# EAGLE design Smarty-BOTTOM (EAGLE 9.5.1)
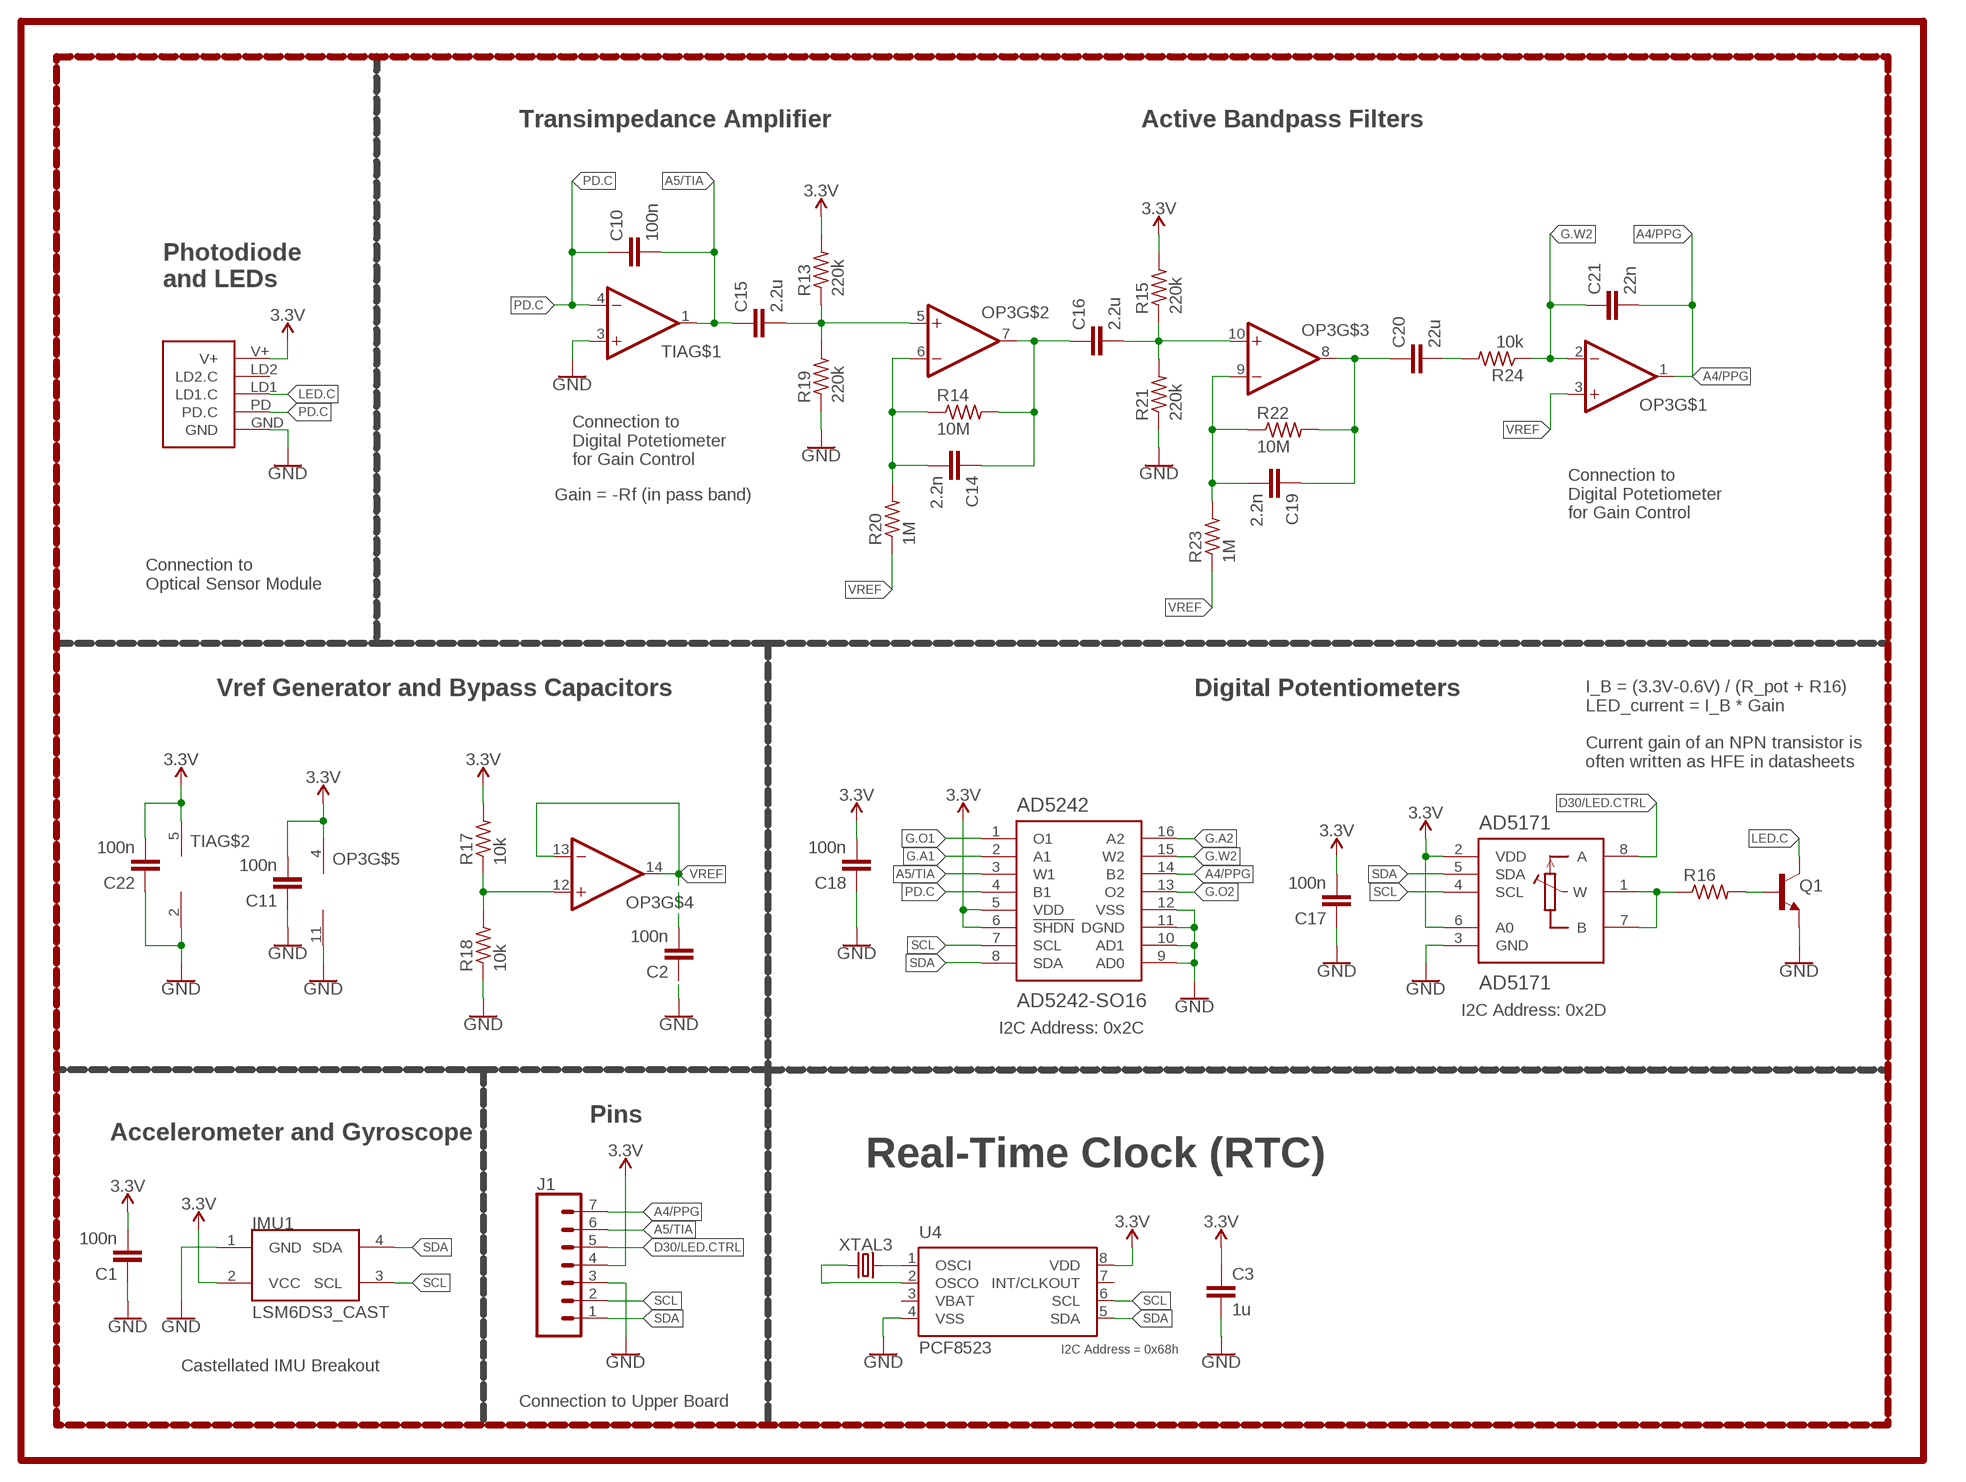
[diagram p0: schematic, sheet 1]

## Parts
AD5171  AD5171  [SOT-23-8]
AD5242  AD5242-SO16  [SO16]
C1  100n  CAPACITOR0603  [C0603]
C2  100n  CAPACITOR0603  [C0603]
C3  1u  CAPACITOR0603  [C0603]
C10  100n  CAPACITOR0603  [C0603]
C11  100n  CAPACITOR0603  [C0603]
C14  2.2n  CAPACITOR0603  [C0603]
C15  2.2u  CAPACITOR0603  [C0603]
C16  2.2u  CAPACITOR0603  [C0603]
C17  100n  CAPACITOR0603  [C0603]
C18  100n  CAPACITOR0603  [C0603]
C19  2.2n  CAPACITOR0603  [C0603]
C20  22u  CAPACITOR0603  [C0603]
C21  22n  CAPACITOR0603  [C0603]
C22  100n  CAPACITOR0603  [C0603]
IMU1  LSM6DS3_CAST  [LSM6DS3_CAST]
J1  CONN_07-1.27MM  [1X07_1.27MM]
OP3  OP-QUAD-SO14  [SO14]
Q1  NPN-GENERIC  [SOT23-3]
R13  220k  RESISTOR0603  [R0603]
R14  10M  RESISTOR0603  [R0603]
R15  220k  RESISTOR0603  [R0603]
R16  RESISTOR0603  [R0603]
R17  10k  RESISTOR0402  [R0402]
R18  10k  RESISTOR0402  [R0402]
R19  220k  RESISTOR0603  [R0603]
R20  1M  RESISTOR0603  [R0603]
R21  220k  RESISTOR0603  [R0603]
R22  10M  RESISTOR0603  [R0603]
R23  1M  RESISTOR0603  [R0603]
R24  10k  RESISTOR0603  [R0603]
TIA  OP-SINGLEOT  [SOT23-5]
U4  PCF8523  [SO8]
U$3  PPG.MODULE.2  [PPG.MODULE.2]
XTAL3  32.7680kHz  CRYSTALECS-.327-12.5-12-C-TR  [2-SMD.NOLEAD.2.0MMTO1.2MM]

## Nets
3.3V: AD5171.2(VDD) AD5171.6(A0) AD5242.5(VDD) AD5242.6(!SHDN) C1.2 C3.1 C11.2 C17.2 C18.2 C22.2 IMU1.2(VCC) J1.4 OP3.4(V+) R13.2 R15.2 R17.2 TIA.5(V+) U4.8(VDD) U$3.V+
A4/PPG: AD5242.14(B2) C21.2 J1.7 OP3.1(OUT)
A5/TIA: AD5242.3(W1) C10.2 C15.1 J1.6 TIA.1(OUT)
D30/LED.CTRL: AD5171.8(A) J1.5
G.A1: AD5242.2(A1)
G.A2: AD5242.16(A2)
G.O1: AD5242.1(O1)
G.O2: AD5242.13(O2)
G.W2: AD5242.15(W2) C21.1 OP3.2(-IN) R24.1
GND: AD5171.3(GND) AD5242.9(AD0) AD5242.10(AD1) AD5242.11(DGND) AD5242.12(VSS) C1.1 C2.1 C3.2 C11.1 C17.1 C18.1 C22.1 IMU1.1(GND) J1.3 OP3.11(V-) Q1.2(E) R18.1 R19.1 R21.1 TIA.2(V-) TIA.3(+IN) U4.4(VSS) U$3.GND
LED.C: Q1.3(C) U$3.LD1(LD1.C)
N$1: U4.2(OSCO) XTAL3.P$1
N$2: U4.1(OSCI) XTAL3.P$2
N$8: Q1.1(B) R16.2
N$9: AD5171.1(W) AD5171.7(B) R16.1
N$10: OP3.12(+IN) R17.1 R18.2
N$13: C15.2 OP3.5(+IN) R13.1 R19.2
N$15: C14.2 OP3.6(-IN) R14.1 R20.2
N$16: C14.1 C16.1 OP3.7(OUT) R14.2
N$17: C16.2 OP3.10(+IN) R15.1 R21.2
N$18: C19.2 OP3.9(-IN) R22.1 R23.2
N$19: C19.1 C20.1 OP3.8(OUT) R22.2
N$20: C20.2 R24.2
PD.C: AD5242.4(B1) C10.1 TIA.4(-IN) U$3.PD(PD.C)
SCL: AD5171.4(SCL) AD5242.7(SCL) IMU1.3(SCL) J1.2 U4.6(SCL)
SDA: AD5171.5(SDA) AD5242.8(SDA) IMU1.4(SDA) J1.1 U4.5(SDA)
VREF: C2.2 OP3.3(+IN) OP3.13(-IN) OP3.14(OUT) R20.1 R23.1
Unconnected: U4.7(INT/CLKOUT) U$3.LD2(LD2.C)

## Notes on the sheet
- Transimpedance Amplifier | Active Bandpass Filters
- Photodiode
  and LEDs
- Connection to 
  Digital Potetiometer
  for Gain Control
- Gain = -Rf (in pass band)
- Connection to 
  Digital Potetiometer
  for Gain Control
- Connection to 
  Optical Sensor Module
- Vref Generator and Bypass Capacitors | Digital Potentiometers
- I_B = (3.3V-0.6V) / (R_pot + R16)
  LED_current = I_B * Gain
  
  Current gain of an NPN transistor is 
  often written as HFE in datasheets
- I2C Address: 0x2D
- I2C Address: 0x2C
- Pins
- Accelerometer and Gyroscope
- Real-Time Clock (RTC)
- I2C Address = 0x68h
- Castellated IMU Breakout
- Connection to Upper Board

## Power pins joined to a net without a drawn wire
VBAT: U4.3(VBAT)

## Library data of the parts
AD5171 = LinnesLab-DigitalIC:AD5171
AD5242 = LinnesLab-DigitalIC:AD5242
C1-C3 C10 C11 C14-C22 = LinnesLab-Passives:CAPACITOR
IMU1 = LinnesLab-Sensors:LSM6DS3_CAST
J1 = LinnesLab-Connectors:CONN_07: Multi connection point. Often used as Generic Header-pin footprint for 0.1 inch spaced/style header connections On any of the 0.1 inch spaced packages, you can populate with these: Break Away Headers - Straight <https://www.sparkfun.com/products/116> (PRT-00116) Break Away Male Headers - Right Angle <https://www.sparkfun.com/products/553> (PRT-00553) Female Headers <https://www.sparkfun.com/products/115> (PRT-00115) Break Away Headers - Machine Pin <https://www.sparkfun.com/products/117> (PRT-00117) Break Away Female Headers - Swiss Machine Pin <https://www.sparkfun.com/products/743> (PRT-00743) For SCREWTERMINALS and SPRING TERMINALS visit here: Screw Terimnals on SparkFun.com <https://www.sparkfun.com/search/results?term=Screw+Terminals> (5mm/3.5mm/2.54mm spacing) This device is also useful as a general connection point to wire up your design to another part of your project. Our various solder wires solder well into these plated through hole pads. Hook-Up Wire - Assortment (Stranded, 22 AWG) <https://www.sparkfun.com/products/11375> (PRT-11375) Hook-Up Wire - Assortment (Solid Core, 22 AWG) <https://www.sparkfun.com/products/11367> (PRT-11367) View the entire wire category on our website here <https://www.sparkfun.com/categories/141> Special notes: Molex polarized connector foot print use with SKU : PRT-08231 with associated crimp pins and housings. 1MM SMD Version SKU: PRT-10208 NOTES ON THE VARIANTS LOCK and LOCK_LONGPADS... This footprint was designed to help hold the alignment of a through-hole component (i.e. 6-pin header) while soldering it into place. You may notice that each hole has been shifted either up or down by 0.005 of an inch from it's more standard position (which is a perfectly straight line). This slight alteration caused the pins (the squares in the middle) to touch the edges of the holes. Because they are alternating, it causes a "brace" to hold the component in place. 0.005 has proven to be the perfect amount of "off-center" position when using our standard breakaway headers. Although looks a little odd when you look at the bare footprint, once you have a header in there, the alteration is very hard to notice. Also,if you push a header all the way into place, it is covered up entirely on the bottom side.
OP3 = LinnesLab-AnalogIC:OP-QUAD: General symbol and footprints for Quad Op Amps. Use with any standard general purpose op amp.
Q1 = LinnesLab-DiscreteSemi:NPN
R13-R24 = LinnesLab-Passives:RESISTOR
TIA = LinnesLab-AnalogIC:OP-SINGLE: Single Op Amp 2.7V to 6.0V Single Supply CMOS Source: http://ww1.microchip.com/downloads/en/DeviceDoc/21314g.pdf
U4 = LinnesLab-Clocks:PCF8523; DIGIKEY: 568-5306-1-ND; I2C_ADDRESS: 0x68h; MFN: PCF8523T/1,118; MFN_MANUFACTURER: NXP USA Inc.
U$3 = LinnesLab-Connectors:PPG.MODULE.2: Digi-Key Part Number: S9014E-50-ND Manufacturer Part Number: GRPB501VWVN-RC Description: 1mm insulation height 0.05in pitch 50 positions
XTAL3 = LinnesLab-Clocks:CRYSTAL

## Board
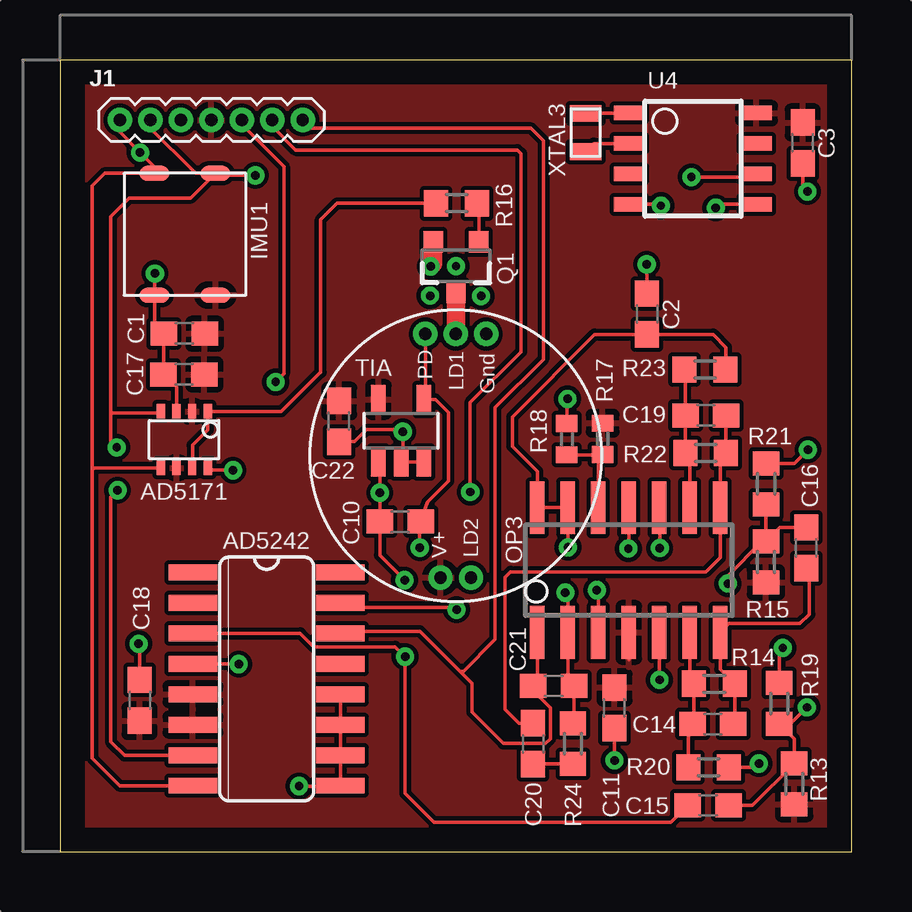
[diagram p1: board, top side]
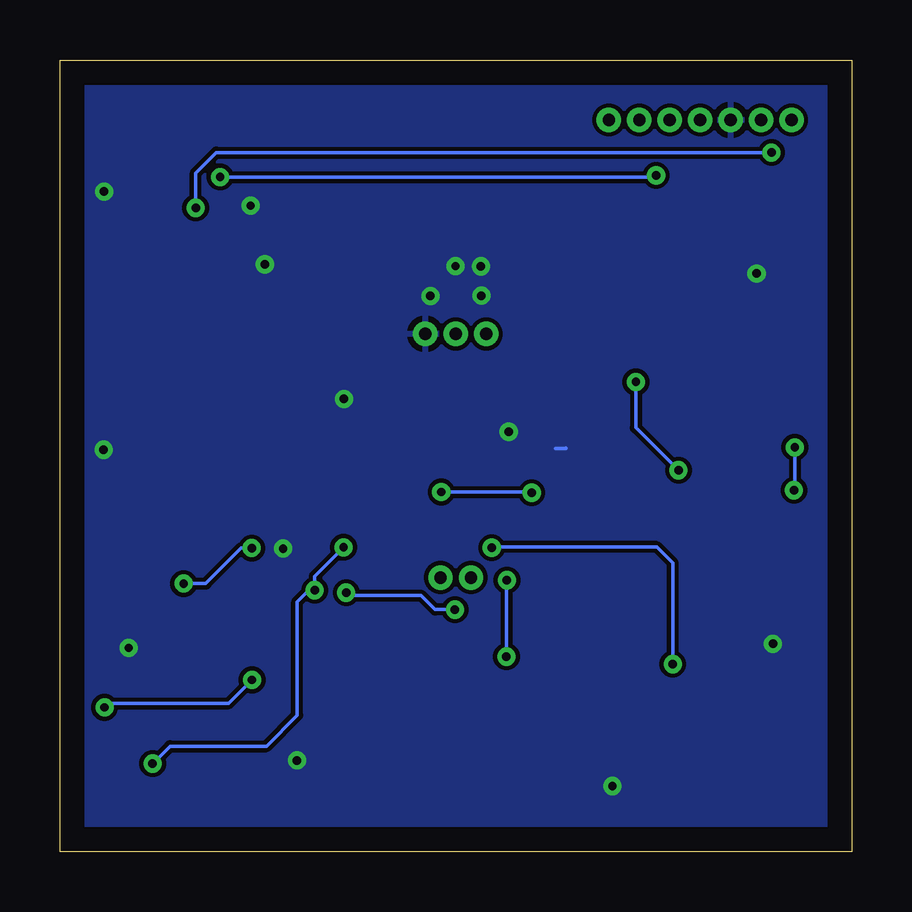
[diagram p2: board, bottom side, seen from below]

Size 33 x 33 mm. Coordinates in mm from the lower left corner, seen from the top.
Outline: 0,0 33,0 33,33 0,33 0,0
Copper layers (1*16): Top 0.035mm / dielectric 1.5mm / Bottom 0.035mm
Design rules "default": minimum track width 6mil, minimum drill 0.35mm, track to track 6mil, track to pad 6mil, pad to pad 6mil, via to via 6mil, smd to smd 6mil, copper to edge 40mil, drill to drill 6mil, minimum pad ring 10mil, minimum via ring 8mil, stop-mask expansion 4mil, vias tented up to drill 0mil, thermal gap 10mil

### Footprints (pad centres in the part's own frame; a part is rotated, then mirrored left to right if it is on the bottom)
SOT-23-8 = smd 0.35 x 0.6: 1 -0.991,-1.176; 2 -0.341,-1.176; 3 0.309,-1.176; 4 0.959,-1.176; 5 0.959,1.176; 6 0.309,1.176; 7 -0.341,1.176; 8 -0.991,1.176
SO16 = smd 0.66 x 2.032: 1 -4.445,-3.073; 2 -3.175,-3.073; 3 -1.905,-3.073; 4 -0.635,-3.073; 5 0.635,-3.073; 6 1.905,-3.073; 7 3.175,-3.073; 8 4.445,-3.073; 9 4.445,3.073; 10 3.175,3.073; 11 1.905,3.073; 12 0.635,3.073; 13 -0.635,3.073; 14 -1.905,3.073; 15 -3.175,3.073; 16 -4.445,3.073
C0603 = smd 1.1 x 1: 1 -0.85,0; 2 0.85,0
LSM6DS3_CAST = smd 0.635 x 1.27: 1 -2.54,1.27; 2 -2.54,-1.27; 3 2.54,-1.27; 4 2.54,1.27
1X07_1.27MM = drill 0.508 pad 1: 1 0,0; 2 1.27,0; 3 2.54,0; 4 3.81,0; 5 5.08,0; 6 6.35,0; 7 7.62,0
SO14 = smd 0.6 x 2.2: 1 -3.81,-2.6; 2 -2.54,-2.6; 3 -1.27,-2.6; 4 0,-2.6; 5 1.27,-2.6; 6 2.54,-2.6; 7 3.81,-2.6; 8 3.81,2.6; 9 2.54,2.6; 10 1.27,2.6; 11 0,2.6; 12 -1.27,2.6; 13 -2.54,2.6; 14 -3.81,2.6
SOT23-3 = smd 0.8 x 0.9: 1 -0.95,-1; 2 0.95,-1; 3 0,1.1
R0603 = smd 1 x 1.1: 1 -0.85,0; 2 0.85,0
R0402 = smd 0.7 x 0.9: 1 -0.65,0; 2 0.65,0
SOT23-5 = smd 0.6 x 1.2: 1 -0.95,-1.306; 2 0,-1.306; 3 0.95,-1.306; 4 0.95,1.306; 5 -0.95,1.306
SO8 = smd 1.3 x 0.6: 1 -2.65,1.905; 2 -2.65,0.635; 3 -2.65,-0.635; 4 -2.65,-1.905; 5 2.65,-1.905; 6 2.65,-0.635; 7 2.65,0.635; 8 2.65,1.905
PPG.MODULE.2 = drill 0.508 pad 0.94: GND 1.27,5.08; LD1 0,5.08; LD2 0.635,-5.08; PD -1.27,5.08; V+ -0.635,-5.08
2-SMD.NOLEAD.2.0MMTO1.2MM = smd 0.7 x 1.3: P$1 -0.8,0; P$2 0.8,0

### Placement (x,y rotation side)
AD5171  5.17,17.17 180 top
AD5242  8.62,7.19 270 top
C1  5.19,21.59 0 top
C2  24.47,22.41 270 top
C3  30.96,29.54 270 top
C10  14.19,13.76 180 top
C11  23.12,5.99 90 top
C14  27.22,5.31 180 top
C15  27.02,1.92 0 top
C16  31.1,12.66 90 top
C17  5.17,19.9 0 top
C18  3.32,6.31 270 top
C19  26.93,18.19 180 top
C20  19.71,4.5 270 top
C21  20.58,6.91 180 top
C22  11.64,17.94 90 top
IMU1  5.21,25.73 90 top
J1  2.5,30.5 0 top
OP3  23.71,11.73 0 top
Q1  16.51,24.42 180 top
R13  30.61,2.82 270 top
R14  27.28,6.99 0 top
R15  29.43,12.07 270 top
R16  16.54,27.03 0 top
R17  22.62,17.21 90 top
R18  21.13,17.19 270 top
R19  29.98,6.17 270 top
R20  27.04,3.51 180 top
R21  29.44,15.33 270 top
R22  26.92,16.62 0 top
R23  26.89,20.09 180 top
R24  21.38,4.5 270 top
TIA  14.22,17.54 0 top
U4  26.39,28.88 0 top
U$3  16.5,16.5 0 top
XTAL3  21.91,29.97 90 top

### Tracks (layer width: path | path; a pad name or v marks a point on that pad's centre or on a via)
3.3V
  Top 0.152: 23.71,8 OP3.4
  pour Top (isolate 0.178): 1.01,32.07 32.02,32.07 32.02,0.93 0.93,0.93 0.93,1.01 0.98,1.01 0.98,32.07 0.98,32.09
A4/PPG
  Top 0.152: OP3.1 19.9,7.08 C21.2 19.73,6.7 20.44,5.99 20.44,4.7 20.25,4.51 18.49,4.51 17.18,5.82 17.18,7.01 16.67,7.52 | AD5242.14 11.77,9.18 15.01,9.18 16.67,7.52 | 16.67,7.52 16.82,7.52 18.14,8.84 18.14,18.52 20.15,20.52 20.15,29.64 19.64,30.15 10.47,30.15 J1.7
A5/TIA  (via drill 0.35)
  Top 0.152: TIA.1 13.34,16.17 v13.34,14.96 C10.2 13.34,12.35 v14.37,11.31 | C15.1 25.47,1.22 15.59,1.22 14.39,2.42 v14.39,8.13 13.98,8.54 10.58,8.54 10.02,9.1 AD5242.3 | v17.1,14.99 17.1,18.72 19.22,20.83 19.22,29.1 19.07,29.25 9.83,29.25 8.85,30.23 J1.6
  Bottom 0.152: v14.37,11.31 14.39,11.3 v14.39,8.13 | v17.1,14.99 13.41,14.99 v13.34,14.96
D30/LED.CTRL  (via drill 0.35)
  Top 0.152: v8.99,19.57 9.34,19.93 9.34,28.55 7.58,30.32 J1.5 | v7.21,15.9 6.26,15.9 AD5171.8
  Bottom 0.152: v8.99,19.57 8.99,17.68 v7.21,15.9
G.W2  (via drill 0.35)
  Top 0.152: v16.54,10.09 16.45,10.18 11.88,10.18 AD5242.15 | v21.07,10.79 21.17,10.68 OP3.2 21.17,7.17 C21.1 21.43,5.4 R24.1
  Bottom 0.152: v16.54,10.09 17.36,10.09 17.95,10.68 20.95,10.68 v21.07,10.79
GND  (via drill 0.35)
  Top 0.152: R18.1 21.13,18.84 v21.16,18.87 | v23.7,12.63 23.71,12.65 OP3.11 | R21.1 30.61,16.18 v31.18,16.75 | v30.13,8.49 29.98,8.34 R19.1 | C11.1 v23.12,3.8 | v3.28,8.66 3.32,8.62 C18.1 | C22.1 12.29,17.09 12.79,17.58 14.21,17.58 v14.29,17.5 14.29,16.3 TIA.2 TIA.3 | AD5242.12 AD5242.11 AD5242.10 AD5242.9 11.67,2.73 v9.97,2.73 | v3.96,24.1 3.94,24.08 IMU1.1 3.94,21.98 C1.1 4.32,21.57 C17.1 4.86,19.36 AD5171.3 | C2.1 24.48,24.46 v24.46,24.48 | C3.2 30.96,27.72 v31.16,27.52 | U4.4 25,26.98 v25.05,26.93
  Top 0.762: Q1.2 15.56,24.51 v15.45,24.4
  Bottom 0.152: 12.34,16.81 11.9,16.81 11.9,16.82 | v14.29,17.5 14.28,17.51 14.28,17.52
  other vias: 17.56,23.16 15.43,23.17 16.51,24.41
  pour Bottom (isolate 0.178): 0.8,32.04 32.08,32.04 32.08,0.86 0.8,0.86
LED.C
  Top 0.762: Q1.3 U$3.LD1
N$1
  Top 0.152: XTAL3.P$1 22.26,29.52 U4.2
N$2
  Top 0.152: U4.1 23.72,30.77 XTAL3.P$2
N$8
  Top 0.152: R16.2 17.46,26.95 Q1.1
N$9
  Top 0.152: AD5171.7 5.52,16.01 5.52,16.94 6.16,17.58 AD5171.1 | AD5171.1 | AD5171.1 9.22,18.35 10.85,19.98 10.87,19.98 10.87,26.34 11.56,27.03 R16.1
N$10
  Top 0.152: OP3.12 22.45,14.34 22.45,16.39 R17.1 22.6,16.54 R18.2
N$13  (via drill 0.35)
  Top 0.152: C15.2 28.86,1.92 R13.1 30.61,4.7 R19.2 30.45,5.32 v31.14,6.01 | OP3.5 v24.98,7.17 v24.99,7.16
  Bottom 0.152: v24.99,7.16 25.96,6.19 30.97,6.19 v31.14,6.01
N$15
  Top 0.152: OP3.6 26.25,7.17 R14.1 26.43,5.37 C14.2 26.19,5.13 R20.2
N$16
  Top 0.152: C14.1 28.13,5.37 R14.2 27.52,7.6 OP3.7 27.89,9.5 30.85,9.5 31.24,9.89 31.24,11.95 C16.1
N$17  (via drill 0.35)
  Top 0.152: R21.2 R15.1 | C16.2 30.02,13.51 R15.1 | v27.84,11.17 27.84,11.5 29.27,12.93 R15.1 | OP3.10 25.01,14.31 v25.01,12.65
  Bottom 0.152: v27.84,11.17 26.92,11.17 25.44,12.65 v25.01,12.65
N$18
  Top 0.152: OP3.9 26.25,16.43 R22.1 26.07,18.18 C19.2 26.08,20.06 R23.2
N$19
  Top 0.152: C20.1 19.13,5.35 18.54,5.94 18.54,11.42 18.79,11.66 26.93,11.66 27.52,12.26 OP3.8 27.52,16.37 R22.2 27.77,18.18 C19.1
N$20
  Top 0.152: R24.2 C20.2 | C20.2
PD.C  (via drill 0.35)
  Top 0.152: U$3.PD 15.23,18.9 TIA.4 15.66,18.85 16.2,18.3 16.2,15.44 15.32,14.57 C10.1 15,13.72 v15,12.67 | AD5242.4 7.44,7.83 v7.45,7.81
  Bottom 0.152: v7.45,7.81 7.45,12.03 8.12,12.69 14.98,12.69 v15,12.67
SCL  (via drill 0.35)
  Top 0.152: J1.2 3.69,30.42 3.69,30.25 5.66,28.27 IMU1.3 | IMU1.3 5.45,27.24 2.89,27.24 2.11,26.46 2.11,18.28 | v2.36,16.85 2.11,17.11 2.11,18.28 | v2.4,15.06 2.12,14.79 2.12,4.58 2.69,4.01 5.53,4.01 AD5242.7 | AD5171.4 4.14,18.28 2.11,18.28 | U4.6 28.91,28.12 v26.32,28.12 | v8.15,28.19 6.57,28.19 IMU1.3
  Bottom 0.152: v2.36,16.85 2.36,15.1 v2.4,15.06 | v26.32,28.12 8.22,28.12 v8.15,28.19
SDA  (via drill 0.35)
  Top 0.152: J1.1 2.5,29.98 v3.34,29.14 3.91,28.57 3.91,28.31 IMU1.4 1.86,28.27 1.35,27.76 1.35,15.9 | 1.35,15.9 1.35,3.89 2.48,2.75 AD5242.8 | AD5171.5 1.44,16 1.35,15.9 | U4.5 27.49,26.98 v27.34,26.83
  Bottom 0.152: v27.34,26.83 27.34,28.29 26.49,29.14 v3.34,29.14
VREF  (via drill 0.35)
  Top 0.152: 24.49,21.55 22.29,21.55 18.86,18.12 18.86,16.89 19.9,15.85 OP3.14 OP3.13 21.18,14.32 21.18,12.53 v21.18,12.68 | 24.49,21.55 27.23,21.55 27.77,21.02 27.77,20.12 R23.1 | R20.1 29.14,3.51 v29.14,3.67 | v22.38,10.9 22.44,10.84 OP3.3 | C2.2 24.48,21.56 24.49,21.55
  Bottom 0.152: v29.14,3.67 28.41,4.39 24.39,4.39 23.11,5.68 23.11,10.41 22.62,10.9 v22.38,10.9 22.38,11.48 v21.18,12.68